# Altium schematic sheet [4] Power ON_OFF.SchDoc: ARS Camera REV01 Power On/OFF
size A3; DrawnBy: Manh Ngo Van; Engineer: Manh Ngo Van; Organization: Altium Limited; Address1: L3, 12a Rodborough Rd; Address2: Frenchs Forest; Address3: NSW; Address4: Australia 2086; DocumentNumber: 4; Revision: 1.0; SheetNumber: 4; SheetTotal: 16
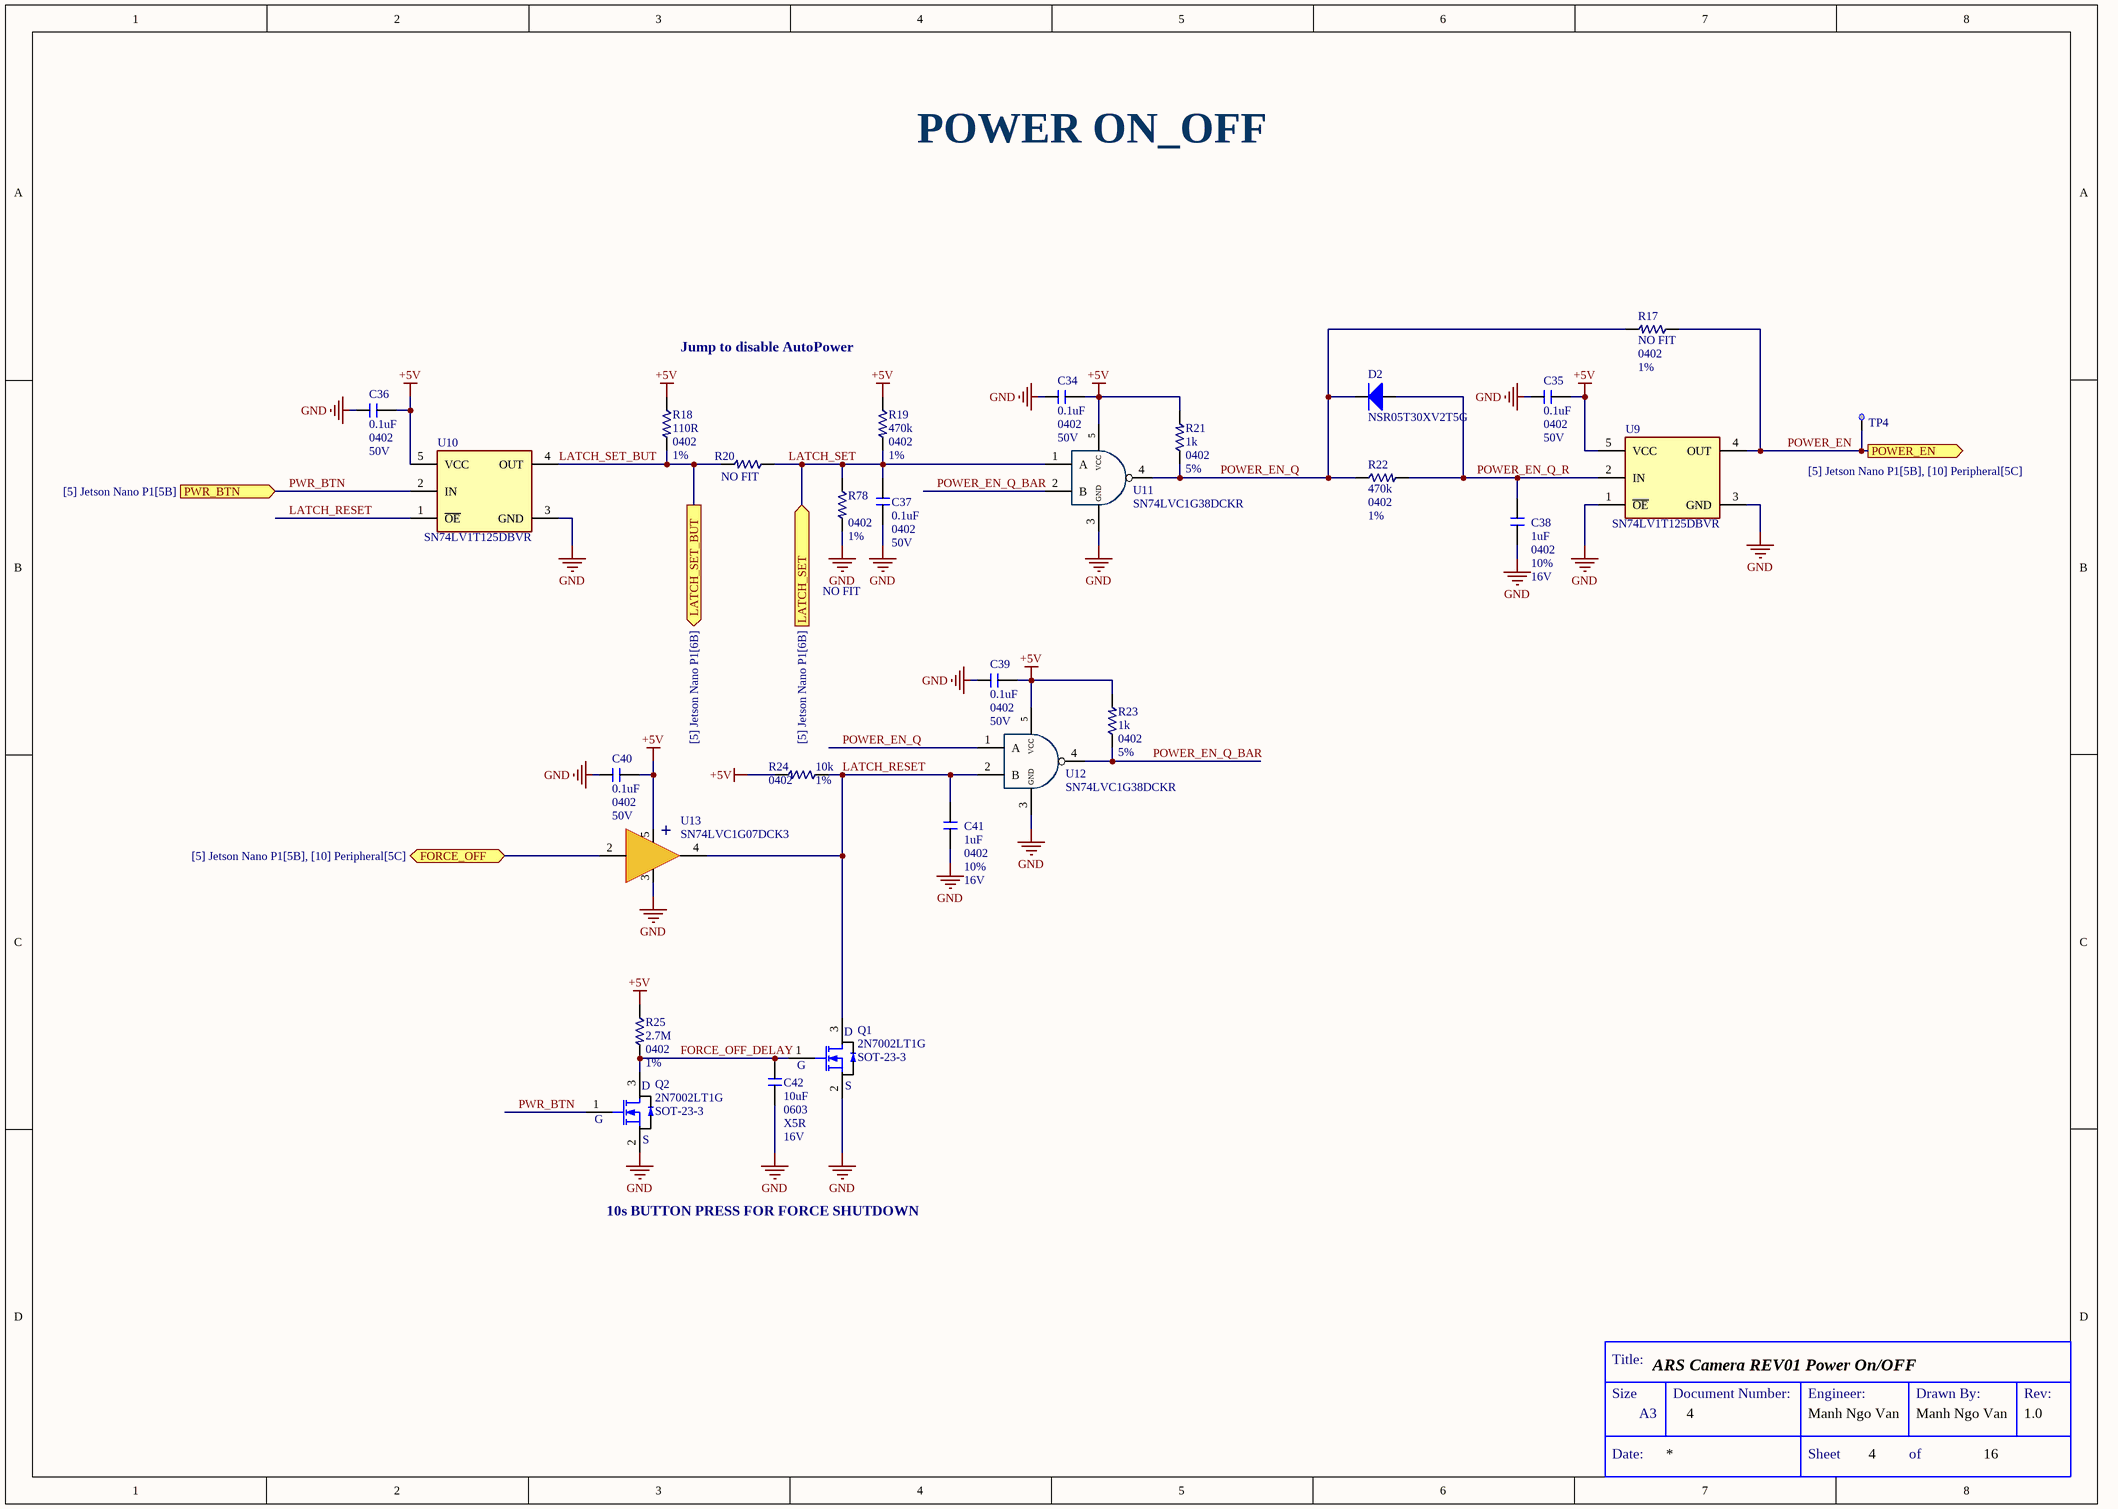
[diagram p0: [4] Power ON_OFF.SchDoc]

## Parts
C34  0.1uF  Case/Package: 0402  Voltage: 50V  [C0402M]
C35  0.1uF  Case/Package: 0402  Voltage: 50V  [C0402M]
C36  0.1uF  Case/Package: 0402  Voltage: 50V  [C0402M]
C37  0.1uF  Case/Package: 0402  Voltage: 50V  [C0402M]
C38  1uF  Case Code (Imperial): 0402  Tolerance: 10%  Voltage: 16V  [C0402M]
C39  0.1uF  Case/Package: 0402  Voltage: 50V  [C0402M]
C40  0.1uF  Case/Package: 0402  Voltage: 50V  [C0402M]
C41  1uF  Case Code (Imperial): 0402  Tolerance: 10%  Voltage: 16V  [C0402M]
C42  10uF  Case/Package: 0603  Dielectric: X5R  Voltage Rating (DC): 16V  [C0603M]
D2  NSR05T30XV2T5G  [SODFL160X70-2N]
Q1  2N7002LT1G  Case/Package: SOT-23-3  [SOT95P245X110-3N]
Q2  2N7002LT1G  Case/Package: SOT-23-3  [SOT95P245X110-3N]
R17  NO FIT  Case/Package: 0402  Tolerance: 1%  [R0402M_NO_3D]
R18  110R  Case Code (Imperial): 0402  Tolerance: 1%  [R0402M]
R19  470k  Case/Package: 0402  Tolerance: 1%  [R0402M]
R20  NO FIT  [R0402M_NO_3D]
R21  1k  Case Code (Imperial): 0402  Tolerance: 5%  [R0402M]
R22  470k  Case/Package: 0402  Tolerance: 1%  [R0402M]
R23  1k  Case Code (Imperial): 0402  Tolerance: 5%  [R0402M]
R24  10k  Case Code (Imperial): 0402  Tolerance: 1%  [R0402M]
R25  2.7M  Case Code (Imperial): 0402  Resistance Tolerance: 1%  [R0402M]
R78  NO FIT  Case/Package: 0402  Tolerance: 1%  [R0402M_NO_3D]
TP4  TP  [Test point]  (value not drawn)  (net tie, no BOM)
U9  SN74LV1T125DBVR  [SN74LV1T125DBVR]
U10  SN74LV1T125DBVR  [SN74LV1T125DBVR]
U11  SN74LVC1G38DCKR  [SOT65P210X110-5N]
U12  SN74LVC1G38DCKR  [SOT65P210X110-5N]
U13  SN74LVC1G07DCK3  [SOT65P210X110-5N]

## Ports
FORCE_OFF (bidir, see [5] Jetson Nano P1[5B], [10] Peripheral[5C]), LATCH_SET (in, see [5] Jetson Nano P1[6B]), LATCH_SET_BUT (out, see [5] Jetson Nano P1[6B]), POWER_EN (out, see [5] Jetson Nano P1[5B], [10] Peripheral[5C]), PWR_BTN (in, see [5] Jetson Nano P1[5B])

## Nets
+5V: C34.1 C35.1 C36.1 C39.1 C40.1 R18.2 R19.2 R21.1 R23.1 R24.1 R25.2 U9.5(VCC) U10.5(VCC) U11.5(VCC) U12.5(VCC) U13.5(VCC)
GND: C34.2 C35.2 C36.2 C37.2 C38.2 C39.2 C40.2 C41.2 C42.1 Q1.2(S) Q2.2(S) R78.1 U9.1(~{OE}) U9.3(GND) U10.3(GND) U11.3(GND) U12.3(GND) U13.3(GND)
FORCE_OFF: U13.2(A) ; port FORCE_OFF
FORCE_OFF_DELAY: C42.2 Q1.1(G) Q2.3(D) R25.1
LATCH_RESET: C41.1 Q1.3(D) R24.2 U10.1(~{OE}) U12.2(B) U13.4(Y)
LATCH_SET: C37.1 R19.1 R20.2 R78.2 U11.1(A) ; port LATCH_SET
LATCH_SET_BUT: R18.1 R20.1 U10.4(OUT) ; port LATCH_SET_BUT
POWER_EN: R17.2 TP4.1(TP) U9.4(OUT) ; port POWER_EN
POWER_EN_Q: D2.1(C) R17.1 R21.2 R22.2 U11.4 U12.1(A)
POWER_EN_Q_BAR: R23.2 U11.2(B) U12.4
POWER_EN_Q_R: C38.1 D2.2(A) R22.1 U9.2(IN)
PWR_BTN: Q2.1(G) U10.2(IN) ; port PWR_BTN

## Notes on the sheet
- POWER ON_OFF
- Jump to disable AutoPower
- 10s BUTTON PRESS FOR FORCE SHUTDOWN
- Title:
- Size
- Document Number:
- Engineer:
- Drawn By:
- Rev:
- Date:
- A3
- Sheet
- of
- (in symbol SN74LVC1G07DCKRE4) +

## Library data of the parts
C34-C37 C39 C40 = CAP_CER: CAP CER 0.1UF 50V X7R 0402; Manufacturer: Murata; Manufacturer Part Number: GRM155R71H104KE14D; Material: Ceramic; Tolerance: 10%; Capacitance: 100nF; Dissipation Factor: 0.025%; ComponentLink1URL: https://datasheet.ciiva.com/25741/cl10b104kb8nnnl-25741341.pdf?src-supplier=Digi-Key; ComponentLink1Description: https://datasheet.ciiva.com/25741/cl10b104kb8nnnl-25741341.pdf?src-supplier=Digi-Key; ComponentLink2URL: https://datasheet.ciiva.com/26838/getdatasheetpartid-357523-26838415.pdf?src-supplier=Verical; ComponentLink2Description: https://datasheet.ciiva.com/26838/getdatasheetpartid-357523-26838415.pdf?src-supplier=Verical; Supplier 1: Digi-Key; Supplier Part Number 1: 490-10700-1-ND; Stock 1: 2282266; Pricing 1: 1 = 0.10000, 10 = 0.04600, 100 = 0.02050, 500 = 0.01464, 1000 = 0.01150, 2500 = 0.01045, 5000 = 0.00961 (USD); RoHS: Yes; Mount: Surface Mount; Weight: 0.000212oz; Case Code (Metric): 1005; Case Code (Imperial): 0402; Dielectric Material: Ceramic; Min Operating Temperature: -55°C; Max Operating Temperature: 125°C; Packaging: Tape and Reel; Dielectric: X7R; Voltage Rating: 50V; Termination: SMD/SMT; Composition: Ceramic; Voltage Rating (DC): 50V; Package Quantity: 10000; Length: 1mm; Height: 0.5mm; Width: 0.5mm; Thickness: 0.022inch; Depth: 0.5mm; REACH SVHC: No SVHC; Lead Free: Lead Free; ComponentLink3URL: http://www.farnell.com/datasheets/2079156.pdf?src-supplier=Farnell; ComponentLink3Description: http://www.farnell.com/datasheets/2079156.pdf?src-supplier=Farnell; ComponentLink4URL: http://www.mouser.com/ds/2/281/c02e-2905.pdf?src-supplier=Mouser; ComponentLink4Description: http://www.mouser.com/ds/2/281/c02e-2905.pdf?src-supplier=Mouser; ComponentLink5URL: http://components.arrow.com/part/dataview/0323_07030614?src-supplier=Arrow+Europe; ComponentLink5Description: http://components.arrow.com/part/dataview/0323_07030614?src-supplier=Arrow+Europe; ComponentLink6URL: https://search.murata.co.jp/Ceramy/image/img/A01X/G101/ENG/GRM155R71H104KE14-01.pdf?src-supplier=Digi-Key; ComponentLink6Description: https://search.murata.co.jp/Ceramy/image/img/A01X/G101/ENG/GRM155R71H104KE14-01.pdf?src-supplier=Digi-Key; ComponentLink7URL: http://psearch.en.murata.com/capacitor/product/GRM155R71H104KE14%23.pdf?src-supplier=Avnet; ComponentLink7Description: http://psearch.en.murata.com/capacitor/product/GRM155R71H104KE14%23.pdf?src-supplier=Avnet; ComponentLink8URL: http://www.farnell.com/datasheets/2079156.pdf?src-supplier=Element14; ComponentLink8Description: http://www.farnell.com/datasheets/2079156.pdf?src-supplier=Element14; ComponentLink9URL: http://www.farnell.com/datasheets/2079156.pdf?src-supplier=Newark; ComponentLink9Description: http://www.farnell.com/datasheets/2079156.pdf?src-supplier=Newark
C38 C41 = CAP_CER: SAMSUNG ELECTRO-MECHANICS - CL05A105KO5NNNC - SMD Multilayer Ceramic Capacitor, 1 µF, 16 V, 0402 [1005 Metric], ± 10%, X5R, CL Series; Supplier 1: Digi-Key; Supplier Part Number 1: 1276-1067-1-ND; Manufacturer 1: Samsung; Manufacturer Part Number 1: CL05A105KO5NNNC; Stock 1: 1039902; Pricing 1: 1=0.10000, 10=0.04600, 50=0.02520, 100=0.02050, 500=0.01466, 1000=0.01151, 2500=0.01046, 5000=0.00963 (USD); RoHS: Yes; Mount: Surface Mount; Case/Package: 0402; Case Code (Metric): 1005; Contact Plating: Tin; Min Operating Temperature: -55°C; Max Operating Temperature: 85°C; Capacitance: 1uF; Dielectric: X5R; Packaging: Tape and Reel; Package Quantity: 1; Voltage Rating: 16V; Series: CL; Construction: Flat; Length: 1mm; Width: 0.02inch; Height: 0.5mm; Thickness: 0.022inch; Depth: 0.5mm; Radiation Hardening: No; RoHS Compliant: Yes; ComponentLink1URL: https://datasheet.ciiva.com/16207/cl05a105ko5nnnc-16207571.pdf?src-supplier=Future+Electronics; ComponentLink1Description: https://datasheet.ciiva.com/16207/cl05a105ko5nnnc-16207571.pdf?src-supplier=Future+Electronics; ComponentLink2URL: https://datasheet.ciiva.com/15195/getdatasheetpartid-355272-15195629.pdf?src-supplier=Verical; ComponentLink2Description: https://datasheet.ciiva.com/15195/getdatasheetpartid-355272-15195629.pdf?src-supplier=Verical
C42 = CAP_CER: CAP CER 10UF 16V X5R 0603; Manufacturer: Taiyo Yuden; Manufacturer Part Number: EMK107BBJ106MA-T; Tolerance: 20%; Supplier 1: Digi-Key; Supplier Part Number 1: 587-3238-1-ND; RoHS: Yes; Category: Ceramic Capacitors; Stock 1: 599529; Pricing 1: 1=0.34000, 10=0.23400, 50=0.16400, 100=0.14060, 500=0.10544, 1000=0.08903 (USD); Mount: Surface Mount; Case Code (Metric): 1608; Case Code (Imperial): 0603; Min Operating Temperature: -55°C; Max Operating Temperature: 85°C; Capacitance: 10uF; Packaging: Tape and Reel; Voltage Rating: 16V; Package Quantity: 1; Termination: SMD/SMT; Series: M; Construction: Flat; Length: 0.063inch; Width: 0.031inch; Height: 0.8mm; Thickness: 0.031inch; RoHS Compliant: Yes; REACH SVHC: Unknown; Halogen Free: Halogen Free; ComponentLink1URL: https://datasheet.ciiva.com/6259/emk107bbj106ma-t-6259169.pdf?src-supplier=Digi-Key; ComponentLink1Description: https://datasheet.ciiva.com/6259/emk107bbj106ma-t-6259169.pdf?src-supplier=Digi-Key; ComponentLink2URL: https://datasheet.ciiva.com/15920/3emk107bbj106ma-t-15920482.pdf?src-supplier=Onlinecomponents.com; ComponentLink2Description: https://datasheet.ciiva.com/15920/3emk107bbj106ma-t-15920482.pdf?src-supplier=Onlinecomponents.com; ComponentLink3URL: https://datasheet.ciiva.com/34372/463emk107bbj106ma-t-34372674.pdf?src-supplier=Onlinecomponents.com; ComponentLink3Description: https://datasheet.ciiva.com/34372/463emk107bbj106ma-t-34372674.pdf?src-supplier=Onlinecomponents.com; ComponentLink4URL: https://datasheet.ciiva.com/6259/emk107bbj106ma-t-6259164.pdf?src-supplier=Digi-Key; ComponentLink4Description: https://datasheet.ciiva.com/6259/emk107bbj106ma-t-6259164.pdf?src-supplier=Digi-Key; ComponentLink5URL: https://datasheet.ciiva.com/6259/emk107bbj106ma-t-6259167.pdf?src-supplier=Digi-Key; ComponentLink5Description: https://datasheet.ciiva.com/6259/emk107bbj106ma-t-6259167.pdf?src-supplier=Digi-Key; ComponentLink6URL: https://datasheet.ciiva.com/13168/mlcc01-e-13168735.pdf?src-supplier=Mouser; ComponentLink6Description: https://datasheet.ciiva.com/13168/mlcc01-e-13168735.pdf?src-supplier=Mouser
D2 = Diode: DIODE SCHOTTKY 30V 500MA SOD523; Manufacturer: ON Semiconductor; Reverse Recovery Time: 23ns; Supplier 1: Digi-Key; Supplier Part Number 1: NSR05T30XV2T5GOSCT-ND; Manufacturer Part Number: NSR05T30XV2T5G; Stock 1: 9501; Pricing 1: 1 = 0.32000, 10 = 0.25800, 100 = 0.10560, 500 = 0.08808, 1000 = 0.06120, 2000 = 0.05688 (USD); RoHS: No; Mount: Surface Mount; Packaging: Cut Tape; Max Reverse Voltage (DC): 30V; Average Rectified Current: 500mA; ComponentLink1URL: http://www.farnell.com/datasheets/2339385.pdf?src-supplier=Farnell; ComponentLink1Description: http://www.farnell.com/datasheets/2339385.pdf?src-supplier=Farnell; ComponentLink2URL: http://www.onsemi.com/pub/Collateral/NSR05T30XV2-D.PDF?src-supplier=Digi-Key; ComponentLink2Description: http://www.onsemi.com/pub/Collateral/NSR05T30XV2-D.PDF?src-supplier=Digi-Key
Q1 Q2 = NMOS: MOSFET N-CH 60V 0.115A SOT-23; Manufacturer: ON Semiconductor; Gate to Source Voltage (Vgs): 20V; Continuous Drain Current (ID): 115mA; Turn-Off Delay Time: 40ns; Turn-On Delay Time: 20ns; Rds On Max: 7.5R; Input Capacitance: 50pF; Nominal Vgs: 2.5V; Number of Elements: 1; Max Power Dissipation: 225mW; Element Configuration: Single; Power Dissipation: 300mW; ComponentLink1URL: https://datasheet.ciiva.com/6371/dmn65d8l-6371124.pdf?src-supplier=Digi-Key; ComponentLink1Description: https://datasheet.ciiva.com/6371/dmn65d8l-6371124.pdf?src-supplier=Digi-Key; ComponentLink2URL: https://datasheet.ciiva.com/13058/dmn65d8l-219098-13058455.pdf?src-supplier=Mouser; ComponentLink2Description: https://datasheet.ciiva.com/13058/dmn65d8l-219098-13058455.pdf?src-supplier=Mouser; ComponentLink3URL: https://datasheet.ciiva.com/6371/dmn65d8l-6371126.pdf?src-supplier=Digi-Key; ComponentLink3Description: https://datasheet.ciiva.com/6371/dmn65d8l-6371126.pdf?src-supplier=Digi-Key; ComponentLink4URL: https://datasheet.ciiva.com/6371/dmn65d8l-6371128.pdf?src-supplier=Digi-Key; ComponentLink4Description: https://datasheet.ciiva.com/6371/dmn65d8l-6371128.pdf?src-supplier=Digi-Key; Supplier 1: Digi-Key; Supplier Part Number 1: 2N7002LT1GOSCT-ND; Manufacturer Part Number: 2N7002LT1G; Stock 1: 616639; Pricing 1: 1 = 0.18000, 10 = 0.16400, 25 = 0.15640, 100 = 0.06880, 250 = 0.06600, 500 = 0.05400, 1000 = 0.03750 (USD); RoHS: Yes; Number of Pins: 3; Contact Plating: Tin,Matte; Min Operating Temperature: -55°C; Max Operating Temperature: 150°C; Package Quantity: 1; On-State Resistance: 7.5R; Packaging: Tape and Reel; Drain to Source Voltage (Vdss): 60V; Drain to Source Breakdown Voltage: 60V; Drain to Source Resistance: 7.5R; Threshold Voltage: 2.5V; Voltage Rating (DC): 60V; Current Rating: 115mA; Number of Channels: 1; Length: 3.04mm; Height: 1.01mm; Width: 1.4mm; Radiation Hardening: No; Lead Free: Lead Free; Halogen Free: Halogen Free; REACH SVHC: No SVHC; ComponentLink5URL: https://datasheet.ciiva.com/936/2n7002l-d-936784.pdf?src-supplier=Digi-Key; ComponentLink5Description: https://datasheet.ciiva.com/936/2n7002l-d-936784.pdf?src-supplier=Digi-Key; ComponentLink6URL: https://datasheet.ciiva.com/22749/1747988-22749570.pdf?src-supplier=Element14; ComponentLink6Description: https://datasheet.ciiva.com/22749/1747988-22749570.pdf?src-supplier=Element14; ComponentLink7URL: https://datasheet.ciiva.com/1188/97418-1188470.pdf?src-supplier=Element14; ComponentLink7Description: https://datasheet.ciiva.com/1188/97418-1188470.pdf?src-supplier=Element14; ComponentLink8URL: https://datasheet.ciiva.com/936/2n7002l-d-936785.pdf?src-supplier=Digi-Key; ComponentLink8Description: https://datasheet.ciiva.com/936/2n7002l-d-936785.pdf?src-supplier=Digi-Key; ComponentLink9URL: https://datasheet.ciiva.com/936/2n7002l-d-936786.pdf?src-supplier=Digi-Key; ComponentLink9Description: https://datasheet.ciiva.com/936/2n7002l-d-936786.pdf?src-supplier=Digi-Key; ComponentLink10URL: https://datasheet.ciiva.com/1254/1747988-1254500.pdf?src-supplier=Newark; ComponentLink10Description: https://datasheet.ciiva.com/1254/1747988-1254500.pdf?src-supplier=Newark; ComponentLink11URL: https://datasheet.ciiva.com/24157/2n7002l-d-24157398.pdf?src-supplier=Future+Electronics; ComponentLink11Description: https://datasheet.ciiva.com/24157/2n7002l-d-24157398.pdf?src-supplier=Future+Electronics; ComponentLink12URL: https://datasheet.ciiva.com/1188/97418-1188471.pdf?src-supplier=Element14; ComponentLink12Description: https://datasheet.ciiva.com/1188/97418-1188471.pdf?src-supplier=Element14; ComponentLink13URL: https://datasheet.ciiva.com/8114/2n7002l-d-8114823.pdf?src-supplier=Avnet; ComponentLink13Description: https://datasheet.ciiva.com/8114/2n7002l-d-8114823.pdf?src-supplier=Avnet; ComponentLink14URL: https://datasheet.ciiva.com/3304/2n7002l-d-3304393.pdf?src-supplier=Avnet; ComponentLink14Description: https://datasheet.ciiva.com/3304/2n7002l-d-3304393.pdf?src-supplier=Avnet; ComponentLink15URL: https://datasheet.ciiva.com/26146/2n7002l-d-26146173.pdf?src-supplier=Avnet+Europe; ComponentLink15Description: https://datasheet.ciiva.com/26146/2n7002l-d-26146173.pdf?src-supplier=Avnet+Europe; ComponentLink16URL: https://datasheet.ciiva.com/16542/2n7002l-d-16542607.pdf?src-supplier=Avnet+Asia; ComponentLink16Description: https://datasheet.ciiva.com/16542/2n7002l-d-16542607.pdf?src-supplier=Avnet+Asia
R17 = RES_SMD: RES SMD 0 OHM JUMPER 1/16W 0402; Manufacturer: Yageo; Manufacturer Part Number: RC0402FR-070RL; Resistance: 0mR; Power Rating: 62.5mW; Voltage Rating: 50V; Temperature Coefficient: 200ppm/°C; Supplier 1: Digi-Key; Supplier Part Number 1: 311-0.0LRCT-ND; Stock 1: 3964331; Pricing 1: 1 = 0.10000, 10 = 0.01200, 25 = 0.00840, 50 = 0.00640, 100 = 0.00470, 250 = 0.00360, 500 = 0.00288, 1000 = 0.00212, 5000 = 0.00152 (USD); RoHS: Yes; Mount: Surface Mount; Contact Plating: Tin,Matte; Case Code (Imperial): 0402; Case Code (Metric): 1005; Min Operating Temperature: -55°C; Max Operating Temperature: 155°C; Resistor Type: Thick Film; Packaging: Tape and Reel; Termination: SMD/SMT; Length: 1mm; Width: 0.5mm; Height: 0.35mm; Radiation Hardening: No; Lead Free: Lead Free; ComponentLink1URL: https://datasheet.ciiva.com/8896/pyu-rc0402-51-rohs-l-6-8896149.pdf?src-supplier=Avnet; ComponentLink1Description: https://datasheet.ciiva.com/8896/pyu-rc0402-51-rohs-l-6-8896149.pdf?src-supplier=Avnet; ComponentLink2URL: https://datasheet.ciiva.com/16790/pyu-rc0402-51-rohs-l-6-r-16790444.pdf?src-supplier=Future+Electronics; ComponentLink2Description: https://datasheet.ciiva.com/16790/pyu-rc0402-51-rohs-l-6-r-16790444.pdf?src-supplier=Future+Electronics; ComponentLink3URL: https://datasheet.ciiva.com/28419/pyu-rc0402-51-rohs-l-6-28419661.pdf?src-supplier=Avnet+Europe; ComponentLink3Description: https://datasheet.ciiva.com/28419/pyu-rc0402-51-rohs-l-6-28419661.pdf?src-supplier=Avnet+Europe; ComponentLink4URL: https://datasheet.ciiva.com/16869/pyu-rc0402-51-rohs-l-6-16869518.pdf?src-supplier=Avnet+Europe; ComponentLink4Description: https://datasheet.ciiva.com/16869/pyu-rc0402-51-rohs-l-6-16869518.pdf?src-supplier=Avnet+Europe
R18 = RES_SMD: RES SMD 110 OHM 1% 1/16W 0402; Manufacturer 1: Yageo; Manufacturer Part Number 1: RC0402FR-07110RL; Mouting Technology: SMT; Power Rating: 63mW; Voltage Rating: 50V; Temperature Coefficient: 100ppm/°C; Pin: 2; Supplier 1: Digi-Key; Supplier Part Number 1: 311-110LRCT-ND; RoHS: Yes; Category: Chip SMD Resistors; Stock 1: 182858; Pricing 1: 1=0.10000, 10=0.01600, 100=0.00660, 1000=0.00299, 2500=0.00259, 5000=0.00214 (USD); Case/Package: 0402; Number of Pins: 2; Case Code (Metric): 1005; Weight: 2.3E-05oz; Size Code: 0402; Min Operating Temperature: -55°C; Max Operating Temperature: 155°C; Resistance: 110R; Packaging: Tape and Reel; Resistor Type: Thick Film; Termination: SMD/SMT; Voltage Rating (DC): 50V; Features: Moisture Resistant; Series: RC; Max Power Dissipation: 63mW; Number of Terminations: 2; Resistance Tolerance: 1%; Construction: Rectangular; Length: 1mm; Width: 0.5mm; Height: 0.35mm; Depth: 0.5mm; REACH SVHC: No SVHC; Military Standard: Not; Lead Free: Lead Free; RoHS Compliant: Yes; ComponentLink1URL: https://datasheet.ciiva.com/12577/pyu-rc0402-51-rohs-l-6-r-12577287.pdf?src-supplier=Mouser; ComponentLink1Description: https://datasheet.ciiva.com/12577/pyu-rc0402-51-rohs-l-6-r-12577287.pdf?src-supplier=Mouser; ComponentLink2URL: https://datasheet.ciiva.com/17070/pyu-rc0402-51-rohs-l-6-r-17070361.pdf?src-supplier=Future+Electronics; ComponentLink2Description: https://datasheet.ciiva.com/17070/pyu-rc0402-51-rohs-l-6-r-17070361.pdf?src-supplier=Future+Electronics; ComponentLink3URL: https://datasheet.ciiva.com/15189/getdatasheetpartid-325087-15189341.pdf?src-supplier=Verical; ComponentLink3Description: https://datasheet.ciiva.com/15189/getdatasheetpartid-325087-15189341.pdf?src-supplier=Verical; ComponentLink4URL: https://datasheet.ciiva.com/7849/1018594-7849822.pdf?src-supplier=Element14; ComponentLink4Description: https://datasheet.ciiva.com/7849/1018594-7849822.pdf?src-supplier=Element14; ComponentLink5URL: https://datasheet.ciiva.com/7849/1018594-7849823.pdf?src-supplier=Element14; ComponentLink5Description: https://datasheet.ciiva.com/7849/1018594-7849823.pdf?src-supplier=Element14
R19 R22 R78 = RES_SMD: RES SMD 470K OHM 1% 1/16W 0402; Manufacturer 1: Yageo; Manufacturer Part Number 1: RC0402FR-07470KL; Mouting Technology: SMT; Resistance: 470kR; Power Rating: 62.5mW; Voltage Rating: 50V; Temperature Coefficient: 100ppm/°C; Max Power Dissipation: 63mW; Pin: 2; Supplier 1: Mouser; Supplier Part Number 1: 603-RC0402FR-07470KL; RoHS: Yes; Category: Chip SMD Resistors; Stock 1: 2975; Pricing 1: 1=0.10000, 10=0.01400, 50=0.01400, 100=0.00500, 1000=0.00300, 10000=0.00200 (USD); Number of Pins: 2; Case Code (Imperial): 0402; Case Code (Metric): 1005; Size Code: 0402; Min Operating Temperature: -55°C; Max Operating Temperature: 155°C; Packaging: Tape and Reel; Voltage Rating (DC): 50V; Package Quantity: 1; Termination: SMD/SMT; Resistor Type: Thick Film; Number of Terminations: 2; Features: Moisture Resistant; Series: RC; Resistance Tolerance: 1%; Construction: Rectangular; Technology: THICK FILM; Length: 1mm; Width: 0.02inch; Height: 0.016inch; Depth: 0.5mm; RoHS Compliant: Yes; REACH SVHC: No SVHC; Military Standard: Not; Lead Free: Lead Free; ComponentLink1URL: https://datasheet.ciiva.com/11819/0900766b80c66297-11819514.pdf?src-supplier=RSComponents; ComponentLink1Description: https://datasheet.ciiva.com/11819/0900766b80c66297-11819514.pdf?src-supplier=RSComponents; ComponentLink2URL: https://datasheet.ciiva.com/46412/1018594-46412837.pdf?src-supplier=Element14; ComponentLink2Description: https://datasheet.ciiva.com/46412/1018594-46412837.pdf?src-supplier=Element14; ComponentLink3URL: https://datasheet.ciiva.com/15189/getdatasheetpartid-325138-15189462.pdf?src-supplier=Verical; ComponentLink3Description: https://datasheet.ciiva.com/15189/getdatasheetpartid-325138-15189462.pdf?src-supplier=Verical; ComponentLink4URL: https://datasheet.ciiva.com/2453/pyu-r-int-thick-7-2453433.pdf?src-supplier=Digi-Key; ComponentLink4Description: https://datasheet.ciiva.com/2453/pyu-r-int-thick-7-2453433.pdf?src-supplier=Digi-Key; ComponentLink5URL: https://datasheet.ciiva.com/2453/pyu-r-int-thick-7-2453434.pdf?src-supplier=Digi-Key; ComponentLink5Description: https://datasheet.ciiva.com/2453/pyu-r-int-thick-7-2453434.pdf?src-supplier=Digi-Key; ComponentLink6URL: https://datasheet.ciiva.com/2453/pyu-r-int-thick-7-2453435.pdf?src-supplier=Digi-Key; ComponentLink6Description: https://datasheet.ciiva.com/2453/pyu-r-int-thick-7-2453435.pdf?src-supplier=Digi-Key; ComponentLink7URL: https://datasheet.ciiva.com/7850/1018594-7850012.pdf?src-supplier=Element14; ComponentLink7Description: https://datasheet.ciiva.com/7850/1018594-7850012.pdf?src-supplier=Element14; ComponentLink8URL: https://datasheet.ciiva.com/7850/1018594-7850013.pdf?src-supplier=Element14; ComponentLink8Description: https://datasheet.ciiva.com/7850/1018594-7850013.pdf?src-supplier=Element14
R20 = RES_SMD: RES SMD 0 OHM JUMPER 1/16W 0402; Manufacturer: Yageo; Manufacturer Part Number: RC0402FR-070RL; Resistance: 0mR; Tolerance: 1%; Power Rating: 62.5mW; Voltage Rating: 50V; Temperature Coefficient: 200ppm/°C; Supplier 1: Digi-Key; Supplier Part Number 1: 311-0.0LRCT-ND; Stock 1: 3964331; Pricing 1: 1 = 0.10000, 10 = 0.01200, 25 = 0.00840, 50 = 0.00640, 100 = 0.00470, 250 = 0.00360, 500 = 0.00288, 1000 = 0.00212, 5000 = 0.00152 (USD); RoHS: Yes; Mount: Surface Mount; Case/Package: 0402; Contact Plating: Tin,Matte; Case Code (Imperial): 0402; Case Code (Metric): 1005; Min Operating Temperature: -55°C; Max Operating Temperature: 155°C; Resistor Type: Thick Film; Packaging: Tape and Reel; Termination: SMD/SMT; Length: 1mm; Width: 0.5mm; Height: 0.35mm; Radiation Hardening: No; Lead Free: Lead Free; ComponentLink1URL: https://datasheet.ciiva.com/8896/pyu-rc0402-51-rohs-l-6-8896149.pdf?src-supplier=Avnet; ComponentLink1Description: https://datasheet.ciiva.com/8896/pyu-rc0402-51-rohs-l-6-8896149.pdf?src-supplier=Avnet; ComponentLink2URL: https://datasheet.ciiva.com/16790/pyu-rc0402-51-rohs-l-6-r-16790444.pdf?src-supplier=Future+Electronics; ComponentLink2Description: https://datasheet.ciiva.com/16790/pyu-rc0402-51-rohs-l-6-r-16790444.pdf?src-supplier=Future+Electronics; ComponentLink3URL: https://datasheet.ciiva.com/28419/pyu-rc0402-51-rohs-l-6-28419661.pdf?src-supplier=Avnet+Europe; ComponentLink3Description: https://datasheet.ciiva.com/28419/pyu-rc0402-51-rohs-l-6-28419661.pdf?src-supplier=Avnet+Europe; ComponentLink4URL: https://datasheet.ciiva.com/16869/pyu-rc0402-51-rohs-l-6-16869518.pdf?src-supplier=Avnet+Europe; ComponentLink4Description: https://datasheet.ciiva.com/16869/pyu-rc0402-51-rohs-l-6-16869518.pdf?src-supplier=Avnet+Europe
R21 R23 = RES_SMD: RES SMD 1K OHM 5% 1/16W 0402; Manufacturer: Yageo; Manufacturer Part Number: RC0402JR-071KL; Resistance: 1kR; Power Rating: 62.5mW; Voltage Rating: 50V; Temperature Coefficient: 100ppm/°C; Max Power Dissipation: 63mW; ComponentLink1URL: https://datasheet.ciiva.com/16855/pyu-rc0201-51-rohs-l-8-16855270.pdf?src-supplier=Avnet+Europe; ComponentLink1Description: https://datasheet.ciiva.com/16855/pyu-rc0201-51-rohs-l-8-16855270.pdf?src-supplier=Avnet+Europe; ComponentLink2URL: https://datasheet.ciiva.com/7672/1563626-7672265.pdf?src-supplier=Element14; ComponentLink2Description: https://datasheet.ciiva.com/7672/1563626-7672265.pdf?src-supplier=Element14; ComponentLink3URL: https://datasheet.ciiva.com/7660/1421516-7660811.pdf?src-supplier=Element14; ComponentLink3Description: https://datasheet.ciiva.com/7660/1421516-7660811.pdf?src-supplier=Element14; ComponentLink4URL: https://datasheet.ciiva.com/46391/1421516-46391293.pdf?src-supplier=Element14; ComponentLink4Description: https://datasheet.ciiva.com/46391/1421516-46391293.pdf?src-supplier=Element14; ComponentLink5URL: https://datasheet.ciiva.com/2462/pyu-r-int-thick-7-2462830.pdf?src-supplier=Digi-Key; ComponentLink5Description: https://datasheet.ciiva.com/2462/pyu-r-int-thick-7-2462830.pdf?src-supplier=Digi-Key; ComponentLink6URL: https://datasheet.ciiva.com/2462/pyu-r-int-thick-7-2462831.pdf?src-supplier=Digi-Key; ComponentLink6Description: https://datasheet.ciiva.com/2462/pyu-r-int-thick-7-2462831.pdf?src-supplier=Digi-Key; ComponentLink7URL: https://datasheet.ciiva.com/8896/pyu-rc0201-51-rohs-l-8-8896175.pdf?src-supplier=Avnet; ComponentLink7Description: https://datasheet.ciiva.com/8896/pyu-rc0201-51-rohs-l-8-8896175.pdf?src-supplier=Avnet; ComponentLink8URL: https://datasheet.ciiva.com/28419/pyu-rc0201-51-rohs-l-8-28419638.pdf?src-supplier=Avnet+Europe; ComponentLink8Description: https://datasheet.ciiva.com/28419/pyu-rc0201-51-rohs-l-8-28419638.pdf?src-supplier=Avnet+Europe; ComponentLink9URL: https://datasheet.ciiva.com/7672/1563626-7672264.pdf?src-supplier=Element14; ComponentLink9Description: https://datasheet.ciiva.com/7672/1563626-7672264.pdf?src-supplier=Element14; ComponentLink10URL: https://datasheet.ciiva.com/2462/pyu-r-int-thick-7-2462829.pdf?src-supplier=Digi-Key; ComponentLink10Description: https://datasheet.ciiva.com/2462/pyu-r-int-thick-7-2462829.pdf?src-supplier=Digi-Key; Supplier 1: Digi-Key; Supplier Part Number 1: 311-1.0KJRCT-ND; Stock 1: 0; Pricing 1: 1 = 0.10000, 10 = 0.01300, 100 = 0.00530, 1000 = 0.00236, 2500 = 0.00205, 5000 = 0.00169 (USD); RoHS: Yes; Case/Package: 0402; Case Code (Metric): 1005; Min Operating Temperature: -55°C; Max Operating Temperature: 155°C; Packaging: Tape and Reel; Package Quantity: 1; Termination: SMD/SMT; Composition: Thick Film; Number of Terminations: 2; Military Standard: Not; Features: Moisture Resistant; Length: 0.039inch; Height: 0.016inch; Width: 0.02inch; Depth: 0.5mm; REACH SVHC: No SVHC; Lead Free: Lead Free; ComponentLink11URL: https://datasheet.ciiva.com/2452/pyu-r-int-thick-7-2452755.pdf?src-supplier=Digi-Key; ComponentLink11Description: https://datasheet.ciiva.com/2452/pyu-r-int-thick-7-2452755.pdf?src-supplier=Digi-Key; ComponentLink12URL: https://datasheet.ciiva.com/2452/pyu-r-int-thick-7-2452756.pdf?src-supplier=Digi-Key; ComponentLink12Description: https://datasheet.ciiva.com/2452/pyu-r-int-thick-7-2452756.pdf?src-supplier=Digi-Key; ComponentLink13URL: https://datasheet.ciiva.com/2452/pyu-r-int-thick-7-2452757.pdf?src-supplier=Digi-Key; ComponentLink13Description: https://datasheet.ciiva.com/2452/pyu-r-int-thick-7-2452757.pdf?src-supplier=Digi-Key; ComponentLink14URL: https://datasheet.ciiva.com/7983/1018594-7983558.pdf?src-supplier=Element14; ComponentLink14Description: https://datasheet.ciiva.com/7983/1018594-7983558.pdf?src-supplier=Element14; ComponentLink15URL: https://datasheet.ciiva.com/7850/1018594-7850170.pdf?src-supplier=Element14; ComponentLink15Description: https://datasheet.ciiva.com/7850/1018594-7850170.pdf?src-supplier=Element14; ComponentLink16URL: https://datasheet.ciiva.com/7850/1018594-7850171.pdf?src-supplier=Element14; ComponentLink16Description: https://datasheet.ciiva.com/7850/1018594-7850171.pdf?src-supplier=Element14; ComponentLink17URL: https://datasheet.ciiva.com/17081/pyu-rc0402-51-rohs-l-6-r-17081438.pdf?src-supplier=Future+Electronics; ComponentLink17Description: https://datasheet.ciiva.com/17081/pyu-rc0402-51-rohs-l-6-r-17081438.pdf?src-supplier=Future+Electronics
R24 = RES_SMD: RES SMD 10K OHM 1% 1/16W 0402; Manufacturer: Yageo; Manufacturer Part Number: RC0402FR-0710KL; Resistance: 10kR; Temperature Coefficient: 100ppm/°C; Voltage Rating (DC): 50V; Power Rating: 62.5mW; Supplier 1: Digi-Key; Supplier Part Number 1: 311-10.0KLRTR-ND; Stock 1: 58760000; Pricing 1: 10000 = 0.001630, 30000 = 0.001440, 50000 = 0.001320, 100000 = 0.001290 (USD); RoHS: Yes; Case/Package: 0402; Number of Pins: 2; Case Code (Metric): 1005; Min Operating Temperature: -55°C; Max Operating Temperature: 155°C; Composition: Thick Film; Packaging: Tape and Reel; Voltage Rating: 50V; Termination: SMD/SMT; Military Standard: Not; Working Voltage: 50V; Number of Terminations: 2; Length: 1mm; Height: 0.32mm; Width: 0.5mm; Depth: 0.5mm; Lead Pitch: 0.2mm; REACH SVHC: No SVHC; Lead Free: Lead Free; ComponentLink1URL: https://datasheet.ciiva.com/7660/38568-7660787.pdf?src-supplier=Element14; ComponentLink1Description: https://datasheet.ciiva.com/7660/38568-7660787.pdf?src-supplier=Element14; ComponentLink2URL: https://datasheet.ciiva.com/7849/1784430-7849813.pdf?src-supplier=Element14; ComponentLink2Description: https://datasheet.ciiva.com/7849/1784430-7849813.pdf?src-supplier=Element14; ComponentLink3URL: https://datasheet.ciiva.com/7849/1686128-7849814.pdf?src-supplier=Element14; ComponentLink3Description: https://datasheet.ciiva.com/7849/1686128-7849814.pdf?src-supplier=Element14; ComponentLink4URL: https://datasheet.ciiva.com/7849/1784430-7849815.pdf?src-supplier=Element14; ComponentLink4Description: https://datasheet.ciiva.com/7849/1784430-7849815.pdf?src-supplier=Element14; ComponentLink5URL: https://datasheet.ciiva.com/22747/1018594-22747512.pdf?src-supplier=Element14; ComponentLink5Description: https://datasheet.ciiva.com/22747/1018594-22747512.pdf?src-supplier=Element14; ComponentLink6URL: https://datasheet.ciiva.com/12667/pyu-rc0402-51-rohs-l-6-r-12667067.pdf?src-supplier=Mouser; ComponentLink6Description: https://datasheet.ciiva.com/12667/pyu-rc0402-51-rohs-l-6-r-12667067.pdf?src-supplier=Mouser; ComponentLink7URL: https://datasheet.ciiva.com/7983/1018594-7983486.pdf?src-supplier=Element14; ComponentLink7Description: https://datasheet.ciiva.com/7983/1018594-7983486.pdf?src-supplier=Element14
R25 = RES_SMD: Res Thick Film 0402 2.7M Ohm 1% 1/16W 100ppm/C Molded SMD SMD Paper T/R; Manufacturer 1: Yageo; Manufacturer Part Number 1: RC0402FR-072M7L; Mouting Technology: SMT; Resistance: 2.7MR; Temperature Coefficient: 100ppm/°C; Power Rating: 62.5mW; Voltage Rating: 50V; Max Power Dissipation: 63mW; Pin: 2; Supplier 1: Digi-Key; Supplier Part Number 1: 13-RC0402FR-072M7LCT-ND; RoHS: Yes; Category: Chip SMD Resistors; Pricing 1: 1=0.10000, 10=0.01600, 100=0.00660, 1000=0.00299, 2500=0.00259, 5000=0.00214 (USD); Case/Package: 0402; Contact Plating: Tin,Lead,Matte; Case Code (Metric): 1005; Size Code: 0402; Min Operating Temperature: -55°C; Max Operating Temperature: 155°C; Tolerance: 1%; Resistor Type: Thick Film; Packaging: Tape and Reel; Number of Terminations: 2; Termination: SMD/SMT; Voltage Rating (DC): 50V; Features: Moisture Resistant; Series: RC; Length: 0.039inch; Width: 0.02inch; Height: 0.016inch; Radiation Hardening: No; REACH SVHC: Unknown; Lead Free: Lead Free; RoHS Compliant: Yes; ComponentLink1URL: https://datasheet.ciiva.com/7849/1018594-7849941.pdf?src-supplier=Element14; ComponentLink1Description: https://datasheet.ciiva.com/7849/1018594-7849941.pdf?src-supplier=Element14; ComponentLink2URL: https://datasheet.ciiva.com/8894/pyu-rc0402-51-rohs-l-6-8894118.pdf?src-supplier=Avnet; ComponentLink2Description: https://datasheet.ciiva.com/8894/pyu-rc0402-51-rohs-l-6-8894118.pdf?src-supplier=Avnet; ComponentLink3URL: https://datasheet.ciiva.com/16868/pyu-rc0402-51-rohs-l-6-16868230.pdf?src-supplier=Avnet+Europe; ComponentLink3Description: https://datasheet.ciiva.com/16868/pyu-rc0402-51-rohs-l-6-16868230.pdf?src-supplier=Avnet+Europe; ComponentLink4URL: https://datasheet.ciiva.com/16742/pyu-rc0402-51-rohs-l-6-16742216.pdf?src-supplier=Future+Electronics; ComponentLink4Description: https://datasheet.ciiva.com/16742/pyu-rc0402-51-rohs-l-6-16742216.pdf?src-supplier=Future+Electronics; ComponentLink5URL: https://datasheet.ciiva.com/28413/pyu-rc0402-51-rohs-l-6-28413882.pdf?src-supplier=Avnet+Europe; ComponentLink5Description: https://datasheet.ciiva.com/28413/pyu-rc0402-51-rohs-l-6-28413882.pdf?src-supplier=Avnet+Europe
TP4 = TestPoint
U9 U10 = SN74LV1T125DBVR: IC BUF NON-INVERT 5.5V SOT23-5; Manufacturer 1: Texas Instruments; Number of Elements: 1; Logic Function: Buffer,Inverting; High Level Output Current: -8mA; Low Level Output Current: 8mA; Min Supply Voltage: 1.6V; Polarity: Non-Inverting; Quiescent Current: 1uA; Supplier 1: Digi-Key; Manufacturer Part Number 1: SN74LV1T125DBVR; Stock 1: 0; Pricing 1: 1=0.50000, 10=0.40900, 25=0.37360, 100=0.27810, 250=0.25208, 500=0.20860, 1000=0.15646 (USD); RoHS: Yes; Mount: Surface Mount; Case/Package: SOT-23-5; Number of Pins: 5; Weight: 0.000353oz; Contact Plating: Gold; Min Operating Temperature: -40°C; Max Operating Temperature: 125°C; Packaging: Tape and Reel; Number of Bits per Element: 1; Number of Bits: 1; Package Quantity: 3000; Max Supply Voltage: 5.5V; Number of Input Lines: 1; Number of Output Lines: 1; Operating Supply Current: 8mA; Radiation Hardening: No; REACH SVHC: No SVHC; Lead Free: Lead Free; RoHS Compliant: Yes; ComponentLink1URL: https://datasheet.ciiva.com/29888/sn74lv1t125-29888035.pdf?src-supplier=Avnet; ComponentLink1Description: https://datasheet.ciiva.com/29888/sn74lv1t125-29888035.pdf?src-supplier=Avnet; ComponentLink2URL: https://datasheet.ciiva.com/29634/sn74lv1t125-29634743.pdf?src-supplier=Digi-Key; ComponentLink2Description: https://datasheet.ciiva.com/29634/sn74lv1t125-29634743.pdf?src-supplier=Digi-Key; ComponentLink3URL: https://datasheet.ciiva.com/29634/sn74lv1t125-29634744.pdf?src-supplier=Digi-Key; ComponentLink3Description: https://datasheet.ciiva.com/29634/sn74lv1t125-29634744.pdf?src-supplier=Digi-Key; ComponentLink4URL: https://datasheet.ciiva.com/29634/sn74lv1t125-29634745.pdf?src-supplier=Digi-Key; ComponentLink4Description: https://datasheet.ciiva.com/29634/sn74lv1t125-29634745.pdf?src-supplier=Digi-Key; ComponentLink5URL: https://datasheet.ciiva.com/30038/sn74lv1t125-30038267.pdf?src-supplier=Avnet; ComponentLink5Description: https://datasheet.ciiva.com/30038/sn74lv1t125-30038267.pdf?src-supplier=Avnet; Supplier Part Number 1: 296-37172-1-ND
U11 U12 = SN74LVC1G38DCKR: IC GATE NAND 1CH 2-INP SC70-5; Manufacturer 1: Texas Instruments; Logic Function: NAND GATE; Max Supply Voltage: 5.5V; Min Supply Voltage: 1.65V; Quiescent Current: 10uA; Number of Elements: 1; Propagation Delay: 3.9ns; Number of Inputs: 2; Low Level Output Current: 32mA; Turn-On Delay Time: 4.5ns; Schmitt Trigger Input: No; Supplier 1: Digi-Key; Manufacturer Part Number 1: SN74LVC1G38DCKR; RoHS: Yes; Category: Logic Gates; Stock 1: 62631; Pricing 1: 1=0.42000, 10=0.31400, 25=0.27440, 100=0.17770, 250=0.14708, 500=0.11766, 1000=0.09021 (USD); Mount: Surface Mount; Case/Package: SC; Number of Pins: 5; Weight: 8.8E-05oz; Contact Plating: Gold; Min Operating Temperature: -40°C; Max Operating Temperature: 125°C; Packaging: Tape and Reel; Number of Outputs: 1; Package Quantity: 1; Number of Circuits: 1; Number of Gates: 1; Number of Input Lines: 2; Number of Output Lines: 1; Series: 74LVC; Technology: CMOS; Number of Bits: 1; Output Current: 32mA; Length: 2mm; Width: 1.25mm; Height: 0.9mm; Radiation Hardening: No; Lead Free: Lead Free; RoHS Compliant: Yes; REACH SVHC: No SVHC; ComponentLink1URL: https://datasheet.ciiva.com/4218/sces538d-4218140.pdf?src-supplier=Arrow+Electronics; ComponentLink1Description: https://datasheet.ciiva.com/4218/sces538d-4218140.pdf?src-supplier=Arrow+Electronics; ComponentLink2URL: https://datasheet.ciiva.com/1869/sn74lvc1g38-1869296.pdf?src-supplier=Digi-Key; ComponentLink2Description: https://datasheet.ciiva.com/1869/sn74lvc1g38-1869296.pdf?src-supplier=Digi-Key; ComponentLink3URL: https://datasheet.ciiva.com/1869/sn74lvc1g38-1869297.pdf?src-supplier=Digi-Key; ComponentLink3Description: https://datasheet.ciiva.com/1869/sn74lvc1g38-1869297.pdf?src-supplier=Digi-Key; ComponentLink4URL: https://datasheet.ciiva.com/46439/1834832-46439173.pdf?src-supplier=Element14; ComponentLink4Description: https://datasheet.ciiva.com/46439/1834832-46439173.pdf?src-supplier=Element14; ComponentLink5URL: https://datasheet.ciiva.com/26048/sn74lvc1g38-26048829.pdf?src-supplier=Avnet+Europe; ComponentLink5Description: https://datasheet.ciiva.com/26048/sn74lvc1g38-26048829.pdf?src-supplier=Avnet+Europe; ComponentLink6URL: https://datasheet.ciiva.com/14291/sn74lvc1g38-14291614.pdf?src-supplier=Avnet; ComponentLink6Description: https://datasheet.ciiva.com/14291/sn74lvc1g38-14291614.pdf?src-supplier=Avnet; ComponentLink7URL: https://datasheet.ciiva.com/1869/sn74lvc1g38-1869295.pdf?src-supplier=Digi-Key; ComponentLink7Description: https://datasheet.ciiva.com/1869/sn74lvc1g38-1869295.pdf?src-supplier=Digi-Key; Supplier Part Number 1: 296-17907-1-ND
U13 = SN74LVC1G07DCKRE4: Buffers & Line Drivers Single w/ OD; Manufacturer: Texas Instruments; Logic Function: Buffer,Inverting; Number of Elements: 1; Max Supply Voltage: 5.5V; Min Supply Voltage: 1.65V; Propagation Delay: 4.2ns; Low Level Output Current: 32mA; Polarity: Non-Inverting; Turn-On Delay Time: 8.3ns; Quiescent Current: 10uA; Supplier 1: Digi-Key; Manufacturer Part Number: SN74LVC1G07DCK3; RoHS: Yes; Category: Buffers, Drivers and Transceivers; Stock 1: 7642; Pricing 1: 1=0.29000, 10=0.23900, 25=0.20040, 100=0.12690, 250=0.09796, 500=0.08348, 1000=0.05676 (USD); Mount: Surface Mount; Case/Package: SC; Number of Pins: 5; Min Operating Temperature: -40°C; Max Operating Temperature: 125°C; Packaging: Tape and Reel; Package Quantity: 1; Number of Channels: 1; Number of Inputs: 1; Number of Outputs: 1; Number of Bits per Element: 1; Number of Input Lines: 1; Number of Output Lines: 1; Number of Gates: 1; Number of Bits: 1; Series: 74LVC; Technology: CMOS; Radiation Hardening: No; REACH SVHC: No SVHC; Lead Free: Lead Free; RoHS Compliant: Yes; ComponentLink1URL: https://datasheet.ciiva.com/14319/sn74lvc1g07-14319317.pdf?src-supplier=Avnet; ComponentLink1Description: https://datasheet.ciiva.com/14319/sn74lvc1g07-14319317.pdf?src-supplier=Avnet; ComponentLink2URL: https://datasheet.ciiva.com/18621/sn74lvc1g07-18621567.pdf?src-supplier=Digi-Key; ComponentLink2Description: https://datasheet.ciiva.com/18621/sn74lvc1g07-18621567.pdf?src-supplier=Digi-Key; Supplier Part Number 1: 296-35936-1-ND